# Altium schematic sheet DigitalCarrierJack.SchDoc
size A4; CompanyName: Technische Hochschule Nürnberg Georg Simon Ohm; Organization: UltraZohm; Address1: Kesslerplatz 12; Address2: 90489 Nürnberg; Address3: GERMANY; SheetNumber: 2; SheetTotal: 8; Website: www.ultrazohm.com
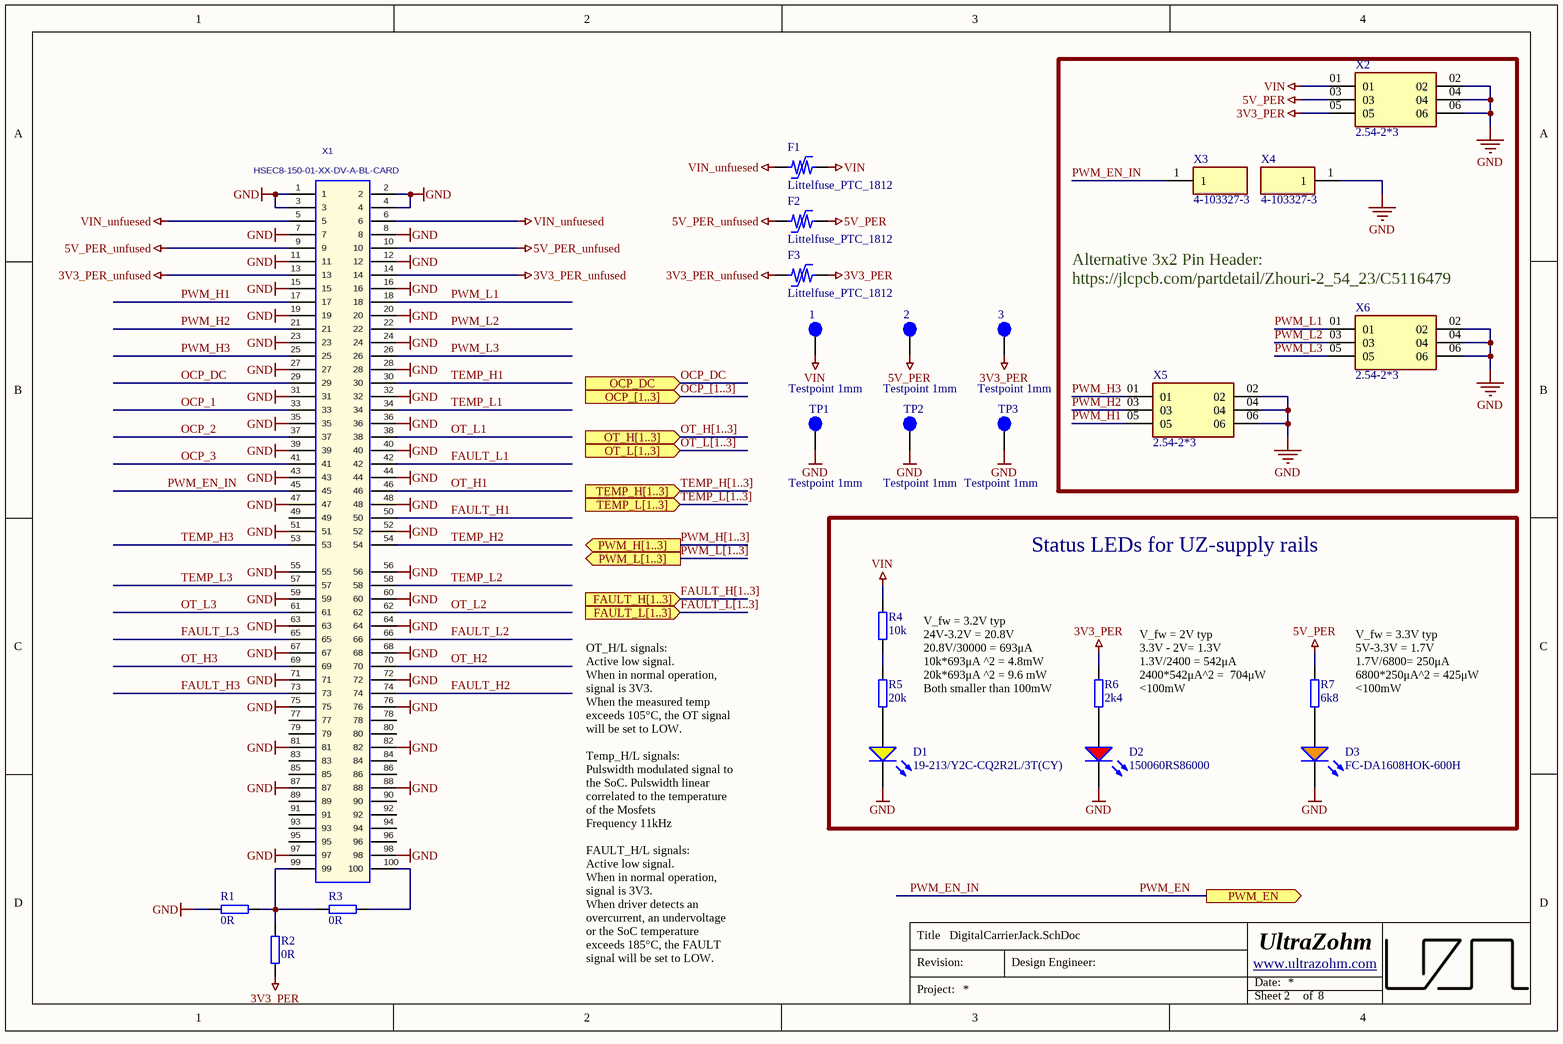
[diagram p0: DigitalCarrierJack.SchDoc]

## Parts
1  Testpoint 1mm  [TP_1mm]  (no BOM)
2  Testpoint 1mm  [TP_1mm]  (no BOM)
3  Testpoint 1mm  [TP_1mm]  (no BOM)
D1  19-213/Y2C-CQ2R2L/3T(CY)  [WL-SMCW_0603]
D2  150060RS86000  [WL-SMCW_0603]
D3  FC-DA1608HOK-600H  [WL-SMCW_0603]
F1  Littelfuse_PTC_1812  [1812_PTC_Polyfuse_Littelfuse]
F2  Littelfuse_PTC_1812  [1812_PTC_Polyfuse_Littelfuse]
F3  Littelfuse_PTC_1812  [1812_PTC_Polyfuse_Littelfuse]
R1  0R  [RES 0603_1608]
R2  0R  [RES 0603_1608]
R3  0R  [RES 0603_1608]
R4  10k  [RES 0603_1608]
R5  20k  [RES 0603_1608]
R6  2k4  [RES 0603_1608]
R7  6k8  [RES 0603_1608]
TP1  Testpoint 1mm  [TP_1mm]  (no BOM)
TP2  Testpoint 1mm  [TP_1mm]  (no BOM)
TP3  Testpoint 1mm  [TP_1mm]  (no BOM)
X1  HSEC8-150-01-XX-DV-A-BL-CARD  [HSEC8-150-01-XX-DV-A-BL-CARD]  (no BOM)
X2  2.54-2*3  [SAMTEC_TSW-103-05-G-D]
X3  4-103327-3  [1_Pin_Header]
X4  4-103327-3  [1_Pin_Header]
X5  2.54-2*3  [SAMTEC_TSW-103-05-G-D]
X6  2.54-2*3  [SAMTEC_TSW-103-05-G-D]

## Blocks framed on the sheet
Status LEDs for UZ-supply rails: D1-D3 R4-R7

## Ports
FAULT_H[1..3] (in), FAULT_L[1..3] (in), OCP_[1..3] (in), OCP_DC (in), OT_H[1..3] (in), OT_L[1..3] (in), PWM_EN (out), PWM_H[1..3] (out), PWM_L[1..3] (out), TEMP_H[1..3] (in), TEMP_L[1..3] (in)

## Nets
3V3_PER: 3.1 F3.2 R2.1 R6.2 X2.05
3V3_PER_unfused: F3.1 X1.13 X1.14
5V_PER: 2.1 F2.2 R7.2 X2.03
5V_PER_unfused: F2.1 X1.9 X1.10
GND: D1.1(K) D2.1(K) D3.1(K) R1.1 TP1.1 TP2.1 TP3.1 X1.1 X1.2 X1.3 X1.4 X1.7 X1.8 X1.11 X1.12 X1.15 X1.16 X1.19 X1.20 X1.23 X1.24 X1.27 X1.28 X1.31 X1.32 X1.35 X1.36 X1.39 X1.40 X1.43 X1.44 X1.47 X1.48 X1.51 X1.52 X1.55 X1.56 X1.59 X1.60 X1.63 X1.64 X1.67 X1.68 X1.71 X1.72 X1.75 X1.76 X1.81 X1.82 X1.87 X1.88 X1.97 X1.98 X2.02 X2.04 X2.06 X4.1 X5.02 X5.04 X5.06 X6.02 X6.04 X6.06
VIN: 1.1 F1.2 R4.2 X2.01
VIN_unfuesed: F1.1 X1.5 X1.6
FAULT_H1: X1.50
FAULT_H2: X1.74
FAULT_H3: X1.73
FAULT_L1: X1.42
FAULT_L2: X1.66
FAULT_L3: X1.65
OCP_1: X1.33
OCP_2: X1.37
OCP_3: X1.41
OCP_DC: X1.29 ; port OCP_DC
OT_H1: X1.46
OT_H2: X1.70
OT_H3: X1.69
OT_L1: X1.38
OT_L2: X1.62
OT_L3: X1.61
PWM_EN: X1.45 X3.1 ; port PWM_EN  [also labelled PWM_EN_IN]
PWM_H1: X1.17 X5.05
PWM_H2: X1.21 X5.03
PWM_H3: X1.25 X5.01
PWM_L1: X1.18 X6.01
PWM_L2: X1.22 X6.03
PWM_L3: X1.26 X6.05
TEMP_H1: X1.30
TEMP_H2: X1.54
TEMP_H3: X1.53
TEMP_L1: X1.34
TEMP_L2: X1.58
TEMP_L3: X1.57
NetD1_2: D1.2(A) R5.1
NetD2_2: D2.2(A) R6.1
NetD3_2: D3.2(A) R7.1
NetR1_2: R1.2 R2.2 R3.1 X1.99
NetR3_2: R3.2 X1.100
NetR4_1: R4.1 R5.2

Not connected (* = marked no-connect by the designer): X1 49 77 78 79 80 83 84 85 86 89 90 91 92 93 94 95 96

## Buses and harness runs
bus FAULT_H[1..3] = port FAULT_H[1..3]
bus FAULT_L[1..3] = port FAULT_L[1..3]
bus OCP_[1..3] = port OCP_[1..3]
bus OT_H[1..3] = port OT_H[1..3]
bus OT_L[1..3] = port OT_L[1..3]
bus PWM_H[1..3] = port PWM_H[1..3]
bus PWM_L[1..3] = port PWM_L[1..3]
bus TEMP_H[1..3] = port TEMP_H[1..3]
bus TEMP_L[1..3] = port TEMP_L[1..3]

## Notes on the sheet
- (near X6) Alternative 3x2 Pin Header:
  https://jlcpcb.com/partdetail/Zhouri-2_54_23/C5116479
- V_fw = 3.2V typ
  24V-3.2V = 20.8V
  20.8V/30000 = 693μA
  10k*693μA ^2 = 4.8mW
  20k*693μA ^2 = 9.6 mW
  Both smaller than 100mW
- V_fw = 2V typ
  3.3V - 2V= 1.3V
  1.3V/2400 = 542μA
  2400*542μA^2 =  704μW
  <100mW
- V_fw = 3.3V typ
  5V-3.3V = 1.7V
  1.7V/6800= 250μA
  6800*250μA^2 = 425μW
  <100mW
- OT_H/L signals:
  Active low signal.
  When in normal operation, signal is 3V3.
  When the measured temp exceeds 105°C, the OT signal will be set to LOW.
- Temp_H/L signals:
  Pulswidth modulated signal to the SoC. Pulswidth linear correlated to the temperature of the Mosfets
  Frequency 11kHz
- FAULT_H/L signals:
  Active low signal.
  When in normal operation, signal is 3V3.
  When driver detects an overcurrent, an undervoltage or the SoC temperature exceeds 185°C, the FAULT signal will be set to LOW.
- Title
- Revision:
- Design Engineer:
- Date:
- Project:
- Sheet
- of

## Library data of the parts
1-3 TP1-TP3 = NULL: Manufacturer Part Number: NULL; Created from: AGeiger; Created: 2018_06_25_AGeiger; Value: Testpoint 1mm; PartID: 9; Created On: 9/20/2022 1:14:57 PM; Component Type: Testpoint; Last Updated: 9/20/2022 1:15:39 PM; Manufacturer: NULL; Supplier 1: NULL; Supplier Part Number 1: NULL; Type: Testpoint; Live Cycle Status: 1
D1 = 19-213/Y2C-CQ2R2L/3T(CY): LED YELLOW 585.5~591.5NM 90~180MCD@20MA TOP VIEW 0603 ROHS; Manufacturer: Everlight Elec; Type: Standard; Created from: T. Wendt; Forward Current I_f: 20 mA; Forward Voltage U_f: 2 V; Wavelength: 590 nm; Light Intensity: 180 mcd; Nominal Power: 40 mW; Manufacturer Part Number: 19-213/Y2C-CQ2R2L/3T(CY); PartID: 9; Created On: 3/3/2021 10:06:23 AM; ComponentLink1Description: Datasheet; ComponentLink1URL: https://datasheet.lcsc.com/szlcsc/Everlight-Elec-19-213-Y2C-CQ2R2L-3T-CY_C72038.pdf; Component Type: LED Diode; Device Package: 0603; Last Updated: 3/4/2021 9:02:49 AM; Mounting Type: SMD; Operating Temperature: -40 - 85 °C; Supplier 1: LCSC; Supplier Part Number 1: C72038; Live Cycle Status: 1; Stock number: not stored; Color: yellow; LCSC Part Number: C72038
D2 = 150060RS86000: WL-SMCW SMD Mono-color Chip LED Waterclear Red; Manufacturer: Wuerth Elektronik; Type: Standard; Created from: MGremer; Forward Current I_f: 20 mA; Forward Voltage U_f: 2 V; Wavelength: 624 nm; Light Intensity: 800 mcd; Nominal Power: 48 mW; Manufacturer Part Number: 150060RS86000; PartID: 3; Created On: 12/8/2020 10:48:12 AM; ComponentLink1Description: Datasheet; ComponentLink1URL: https://www.mouser.de/datasheet/2/445/150120RS75000-1714636.pdf; Component Type: LED Diode; Device Package: 0603; Last Updated: 2/15/2023 6:12:03 PM; Mounting Type: SMD; Operating Temperature: -40 - 85 °C; Supplier 1: Mouser; Supplier Part Number 1: 710-150060RS86000; Supplier 2: Farnell; Supplier Part Number 2: 3408608; Supplier 3: Digi-Key; Supplier Part Number 3: 732-150060RS86000CT-ND; Live Cycle Status: 1; Stock number: not stored; Color: red; LCSC Part Number: C389517
D3 = FC-DA1608HOK-600H: LED ORANGE 600~610NM 80~220MCD@20MA TOP VIEW 0603 ROHS; Manufacturer: Foshan NationStar Optoelectronics; Type: Standard; Created from: T. Wendt; Color: amber; Forward Current I_f: 20 mA; Forward Voltage U_f: 2 V; Wavelength: 604 nm; Light Intensity: 150 mcd; Nominal Power: 40 mW; Manufacturer Part Number: FC-DA1608HOK-600H; PartID: 10; Created On: 3/3/2021 9:59:51 AM; ComponentLink1Description: Datasheet; ComponentLink1URL: https://datasheet.lcsc.com/szlcsc/Foshan-NationStar-Optoelectronics-FC-DA1608HOK-600H_C84269.pdf; Component Type: LED Diode; Device Package: 0603; Last Updated: 3/4/2021 9:02:50 AM; Mounting Type: SMD; Operating Temperature: -40 - 85 °C; Supplier 1: LCSC; Supplier Part Number 1: C84269; Live Cycle Status: 1; Stock number: not stored; LCSC Part Number: C84269
F1-F3 = Littelfuse_PTC_1812: POLYSWITCH RESETTABLE DEVICES; MPN: miniASMDC110F/24; Value: PTC, 1.1 A, 24V; Voltage: 24V; Trip Current: 2.2A; Hold Current: 1.1A; Resistance: 0.18 Ohm; Type: Fuse; Nominal current: 1 A; Created from: MHlatky; MF: Littelfuse; Created: 2019_02_10_AGeiger; Package: 1812; ComponentLink1URL: https://www.littelfuse.com/~/media/electronics/datasheets/resettable_ptcs/littelfuse_ptc_surface_mount_catalog_datasheet.pdf.pdf; ComponentLink1Description: Datasheet; Manufacturer Part Number: Littelfuse_PTC_1812; PartID: 5; Created On: 5/7/2021 6:50:33 AM; Component Type: Littelfuse_PTC_1812; Last Updated: 5/27/2022 3:06:17 PM; Manufacturer: Littelfuse; Mounting Type: SMD; Operating Temperature: -40 - 85 °C; Supplier 1: Mouser; Supplier Part Number 1: 530-0ZCG0150BF2C; Live Cycle Status: 1; LCSC Part Number: C70119
R1-R3 = RC0603JR-070RL: SMD resistor E24 series; Manufacturer: YAGEO; Tolerance: 5%; Created from: MGremer; Manufacturer Part Number: RC0603JR-070RL; PartID: 1; Created On: 12/14/2020 4:17:14 PM; ComponentLink1Description: Datasheet; ComponentLink1URL: https://www.mouser.de/datasheet/2/447/PYu-RC_Group_51_RoHS_L_10-1664068.pdf; Component Type: SMD resistor; Device Package: 0603; Last Updated: 3/4/2021 9:09:42 AM; Mounting Type: SMD; Supplier 1: Mouser; Supplier Part Number 1: 603-RC0603JR-070RL; Supplier 2: LCSC; Supplier Part Number 2: C21189; Type: Resistor; Value: 0R; Live Cycle Status: 1; Stock number: Labor SMD Container; LCSC Part Number: C21189
R4 = RK73B1JTTD103J: SMD resistor E24 series; Manufacturer: KOA Speer; Tolerance: 5%; Created from: MGremer; Manufacturer Part Number: RK73B1JTTD103J; PartID: 98; Created On: 12/14/2020 4:17:14 PM; ComponentLink1Description: Datasheet; ComponentLink1URL: https://www.mouser.de/datasheet/2/219/RK73B-1825463.pdf; Component Type: SMD resistor; Device Package: 0603; Last Updated: 5/27/2022 2:04:22 PM; Mounting Type: SMD; Supplier 1: Mouser; Supplier Part Number 1: 660-RK73B1JTTD103J; Type: Resistor; Value: 10k; Live Cycle Status: 1; Stock number: Labor SMD Container; LCSC Part Number: C25804
R5 = 0603WAF2002T5E: SMD resistor E24 series; Manufacturer: UNI-ROYAL; Tolerance: 1%; Created from: AGeiger; Manufacturer Part Number: 0603WAF2002T5E; PartID: 105; Created On: 12/14/2020 4:17:14 PM; ComponentLink1Description: Datasheet; ComponentLink1URL: https://datasheet.lcsc.com/lcsc/2206010230_UNI-ROYAL-Uniroyal-Elec-0603WAF2002T5E_C4184.pdf; Component Type: SMD resistor; Device Package: 0603; Last Updated: 8/25/2022 8:05:50 PM; Mounting Type: SMD; Supplier 1: LCSC; Supplier Part Number 1: C4184; Type: Resistor; Value: 20k; Live Cycle Status: 1; Stock number: Labor SMD Container; LCSC Part Number: C4184
R6 = CR0603F2K40P05Z: 100mW ±100ppm/℃ ±1% 2.4kΩ 0603 Chip Resistor - Surface Mount ROHS; Manufacturer: Ever Ohms Tech; Created from: KIlhan; Manufacturer Part Number: CR0603F2K40P05Z; PartID: 278; Created On: 7/5/2023 5:27:52 PM; ComponentLink1Description: Datasheet; ComponentLink1URL: https://jlcpcb.com/partdetail/Ever_OhmsTech-CR0603F2K40P05Z/C881363; Component Type: SMD resistor; Device Package: 0603; Last Updated: 7/5/2023 5:27:52 PM; Mounting Type: SMD; Supplier 1: LCSC; Supplier Part Number 1: C881363; Type: Resistor; Tolerance: 1%; Value: 2k4; Live Cycle Status: 1; Stock number: not stored; LCSC Part Number: C881363
R7 = RS-03K682JT: 100mW ±100ppm/℃ ±5% 6.8kΩ 0603  Chip Resistor - Surface Mount ROHS; Manufacturer: FH (Guangdong Fenghua Advanced Tech); Created from: KIlhan; Manufacturer Part Number: RS-03K682JT; PartID: 279; Created On: 7/5/2023 6:08:31 PM; ComponentLink1Description: Datasheet; ComponentLink1URL: https://jlcpcb.com/parts/2nd/Resistors/Chip_Resistor_Surface_Mount_4?searchTxt=6.8k; Component Type: SMD resistor; Device Package: 0603; Last Updated: 7/5/2023 6:19:43 PM; Supplier 1: LCSC; Supplier Part Number 1: C118365; Type: Resistor; Tolerance: 5%; Value: 6k8; Live Cycle Status: 1; Stock number: not stored; LCSC Part Number: C118365; Mounting Type: SMD
X1 = HSEC8-150-01-XX-DV-A-BL-CARD: Mating Card Layout for HSEC8-150-01-XX-DV-A-BL; Manufacturer: SAMTEC; Created: 2018_04_23_AGeiger; Value: HSEC8-150-01-XX-DV-A-BL-CARD
X2 X5 X6 = 2.54-2*3: Pin Header 3x2; Manufacturer: ZHOURI; MF: Samtec; Created from: KIlhan; Number of positions: 3; Availability: Unavailable; Value: *; Price: None; MP: TSW-103-05-G-D; Package: None; Manufacturer Part Number: 2.54-2*3; PartID: 14; Created On: 7/5/2023 4:24:09 PM; ComponentLink1Description: Datasheet; ComponentLink1URL: https://datasheet.lcsc.com/lcsc/2207291800_ZHOURI-2-54-1-3_C5116482.pdf; Component Type: Pin Header; Device Package: THT; Last Updated: 7/5/2023 4:24:09 PM; Mounting Type: THT; Operating Temperature: -55 -125 °C; Series: 2.54-1*3; Supplier 1: LCSC; Supplier Part Number 1: ZHOURI 2.54-1*3; Type: Pin Header; Live Cycle Status: 1; Stock number: not stored; Number of rows: 2; LCSC Part Number: C5116479
X3 X4 = 4-103327-3: Pin Header, 2.54mm, 1 Pin; Manufacturer: TE Connectivity; Created from: DHufnagel; Number of positions: 1; Manufacturer Part Number: 4-103327-3; PartID: 12; Created On: 8/18/2022 9:37:37 AM; ComponentLink1Description: Datasheet; ComponentLink1URL: https://www.mouser.de/datasheet/2/418/NG_CD_103327_T_baseFilename-749242.pdf; Component Type: Pin Header; Device Package: THT; Last Updated: 6/16/2023 12:29:10 PM; Mounting Type: THT; Operating Temperature: -65 - 105 °C; Series: AMPMODU MOD II; Supplier 1: Mouser; Supplier Part Number 1: 571-4-103327-3; Type: Pin Header; Live Cycle Status: 1; LCSC Part Number: C3347196; Stock number: not stored; Number of rows: 1